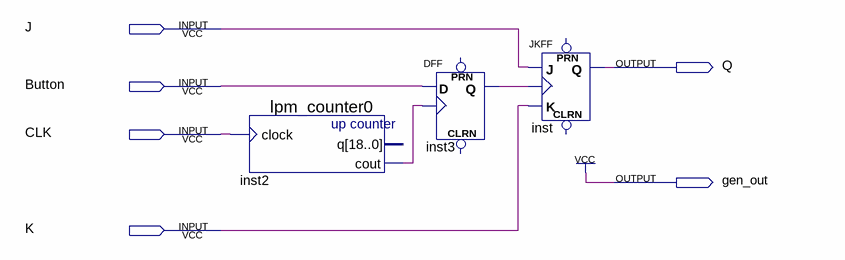
[diagram p0: schematic sheet]
// Quartus schematic scheme5.bdf as structural Verilog: 3 symbols, 6 pins
module scheme5 (
  input  J,
  input  Button,
  input  CLK,
  input  K,
  output Q,
  output gen_out
);

  wire inst2_cout, inst3_q;

  lpm_counter0 inst2 (.clock(CLK), .cout(inst2_cout));  // open: q
  DFF inst3 (.CLK(inst2_cout), .D(Button), .Q(inst3_q));  // open: CLRN, PRN
  JKFF inst (.K(K), .J(J), .CLK(inst3_q), .Q(Q));  // open: PRN, CLRN

  assign gen_out = 1'b1;
endmodule
